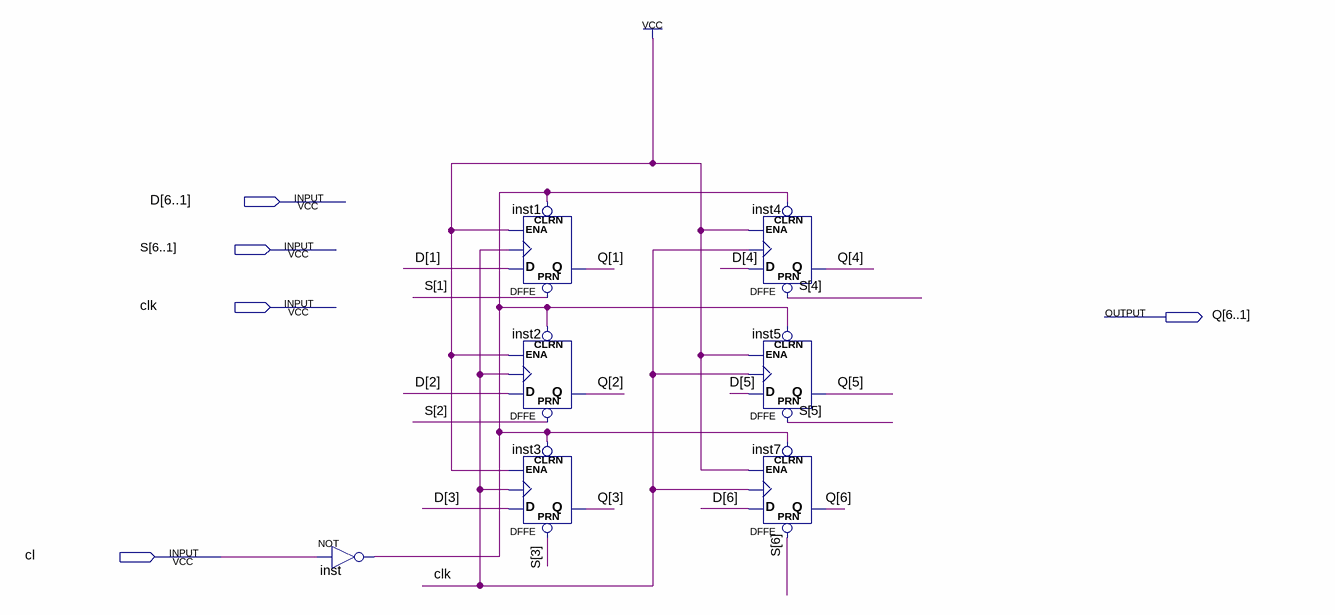
[diagram p0: schematic sheet]
// Quartus schematic mc.bdf as structural Verilog: 7 symbols, 5 pins
module mc (
  input  [6:1] D,
  input  [6:1] S,
  input  clk,
  input  cl,
  output [6:1] Q
);

  wire inst_out;

  not inst (inst_out, cl);
  DFFE inst1 (.PRN(S[1]), .CLRN(inst_out), .D(D[1]), .CLK(clk), .ENA(1'b1), .Q(Q[1]));
  DFFE inst2 (.PRN(S[2]), .CLRN(inst_out), .D(D[2]), .CLK(clk), .ENA(1'b1), .Q(Q[2]));
  DFFE inst3 (.PRN(S[3]), .CLRN(inst_out), .D(D[3]), .CLK(clk), .ENA(1'b1), .Q(Q[3]));
  DFFE inst4 (.PRN(S[4]), .CLRN(inst_out), .D(D[4]), .CLK(clk), .ENA(1'b1), .Q(Q[4]));
  DFFE inst5 (.PRN(S[5]), .CLRN(inst_out), .D(D[5]), .CLK(clk), .ENA(1'b1), .Q(Q[5]));
  DFFE inst7 (.PRN(S[6]), .CLRN(inst_out), .D(D[6]), .CLK(clk), .ENA(1'b1), .Q(Q[6]));
endmodule
